# Altium schematic sheet Oscilator.SchDoc
size A; SheetNumber: 9; SheetTotal: 10
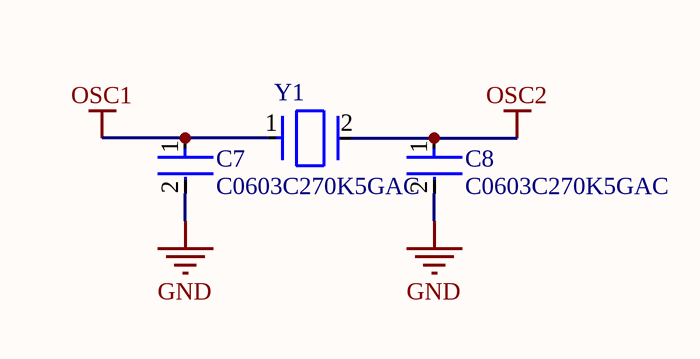
[diagram p0: Oscilator.SchDoc]

## Parts
C7  C0603C270K5GAC  [FP-C0603C-CF-MFG]
C8  C0603C270K5GAC  [FP-C0603C-CF-MFG]
Y1  ABM3-8.000MHZ-D2Y-T  [FP-ABM3-MFG]  (value not drawn)

## Nets
GND: C7.2 C8.2
OSC1: C7.1 Y1.1
OSC2: C8.1 Y1.2

## Library data of the parts
C7 C8 = CMP-03020-019774-1: C0603 27 pF C0G 30ppm/°C 10.00% 50 V; Manufacturer: KEMET; Tolerance: 0.1; Automotive Grade: Grade 1; Voltage Rating: 50 V; Capacitance: 27 pF; Material: Ceramic; Value: 27 pF; Package: C0603C-CF; Temperature: -55°C to +125°C; Device Class L1: Passive Components; Lead Free: Yes; Mouser Description: Multilayer Ceramic Capacitors MLCC - SMD/SMT 50volts 27pF 10% C0G; Temperature Coefficient: 30ppm/°C; Octopart: https://octopart.com/c0603c270k5gac-kemet-8089732; ComponentLink2Description: Datasheet; Manufacturer Part Number: C0603C270K5GAC; Device Class L3: Ceramic Capacitors; Category: Cap; Temperature Characteristic: C0G; Temperature Range Low: -55°C; Automotive: Yes; Height: 0.87mm; ComponentLink2URL: https://api.kemet.com/component-edge/download/datasheet/C0603C100J5GACAUTO.pdf; Temperature Range High: +125°C; Device Class L2: Capacitors; RoHS: TRUE
Y1 = CMP-2000-05033-2: Crystal 8MHz ±20ppm 18pF SMD-2 5mm x 3.2mm; Series Resistance: 500R; Frequency Stability: 30ppm; ESR (Equivalent Series Resistance): 140R; Load Capacitance: 18pF; Height: 0.051inch; Tolerance: 20ppm; Depth: 3.2mm; Max Operating Temperature: 85°C; Frequency: 8MHz; Termination: SMD/SMT; Lead Free: Lead Free; Number of Pins: 2; Width: 3.2mm; RoHS Compliant: Yes; Resistor Type: Ceramic; Length: 5mm; Mount: Surface Mount; Case/Package: CSMD; Package Quantity: 1000; Radiation Hardening: No; Min Operating Temperature: -40°C; Packaging: Tape and Reel; Frequency Tolerance: 20ppm